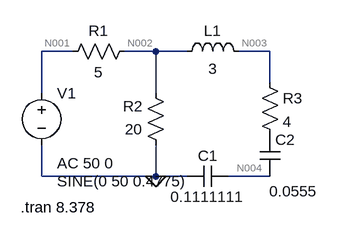
[diagram p0: schematic Task1-3.asc]
Task1-3.asc, the LTspice schematic file:
Version 4
SHEET 1 880 680
WIRE 176 48 128 48
WIRE 304 48 256 48
WIRE 352 48 304 48
WIRE 480 48 432 48
WIRE 480 96 480 48
WIRE 128 112 128 48
WIRE 304 112 304 48
WIRE 128 240 128 192
WIRE 304 240 304 192
WIRE 304 240 128 240
WIRE 352 240 304 240
WIRE 480 240 416 240
FLAG 304 240 0
SYMBOL voltage 128 96 R0
WINDOW 123 24 124 Left 2
WINDOW 39 0 0 Left 0
WINDOW 3 24 152 Left 2
SYMATTR Value2 AC 50 0
SYMATTR Value SINE(0 50 0.4775)
SYMATTR InstName V1
SYMBOL res 272 32 R90
WINDOW 0 0 56 VBottom 2
WINDOW 3 32 56 VTop 2
SYMATTR InstName R1
SYMATTR Value 5
SYMBOL res 320 208 R180
WINDOW 0 36 76 Left 2
WINDOW 3 36 40 Left 2
SYMATTR InstName R2
SYMATTR Value 20
SYMBOL ind 336 64 R270
WINDOW 0 32 56 VTop 2
WINDOW 3 5 56 VBottom 2
SYMATTR InstName L1
SYMATTR Value 3
SYMBOL cap 416 224 R90
WINDOW 0 0 32 VBottom 2
WINDOW 3 32 32 VTop 2
SYMATTR InstName C1
SYMATTR Value 0.1111111
SYMBOL res 464 80 R0
SYMATTR InstName R3
SYMATTR Value 4
SYMBOL cap 464 176 R0
WINDOW 3 15 87 Left 2
SYMATTR Value 0.0555
SYMATTR InstName C2
TEXT 96 288 Left 2 !.tran 8.378

The netlist it stands for:
* Task1-3.asc
V1 N001 0 SINE(0 50 0.4775) AC 50 0
R1 N002 N001 5
R2 0 N002 20
L1 N002 N003 3
C1 N004 0 0.1111111
R3 N003 P001 4
C2 P001 N004 0.0555
.tran 8.378
.backanno
.end

* Results of the author's LTspice run, read from the files saved beside the schematic
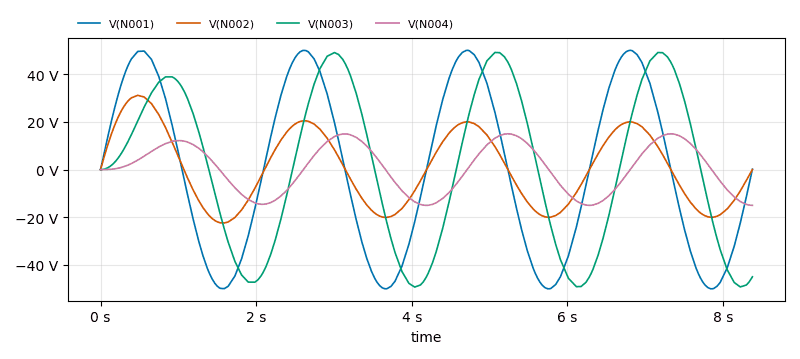
[diagram p1: Transient Analysis of Task1-3.asc, plotted from the saved traces]
* Transient Analysis, 1 run:
*   V(N001): min -49.98 V, max 49.98 V, average -5.53 mV, rms 35.35 V, last 155.5 mV
*   V(N002): min -22.39 V, max 31.14 V, average 792.2 mV, rms 15.64 V, last 52.61 mV
*   V(N003): min -49.25 V, max 49.11 V, average 787.6 mV, rms 33.44 V, last -44.95 V
*   V(N004): min -15.01 V, max 15 V, average 527.7 mV, rms 10.06 V, last -15 V